# Altium schematic sheet PC104_Connectors.SchDoc
size Letter; SheetNumber: 1; SheetTotal: 2
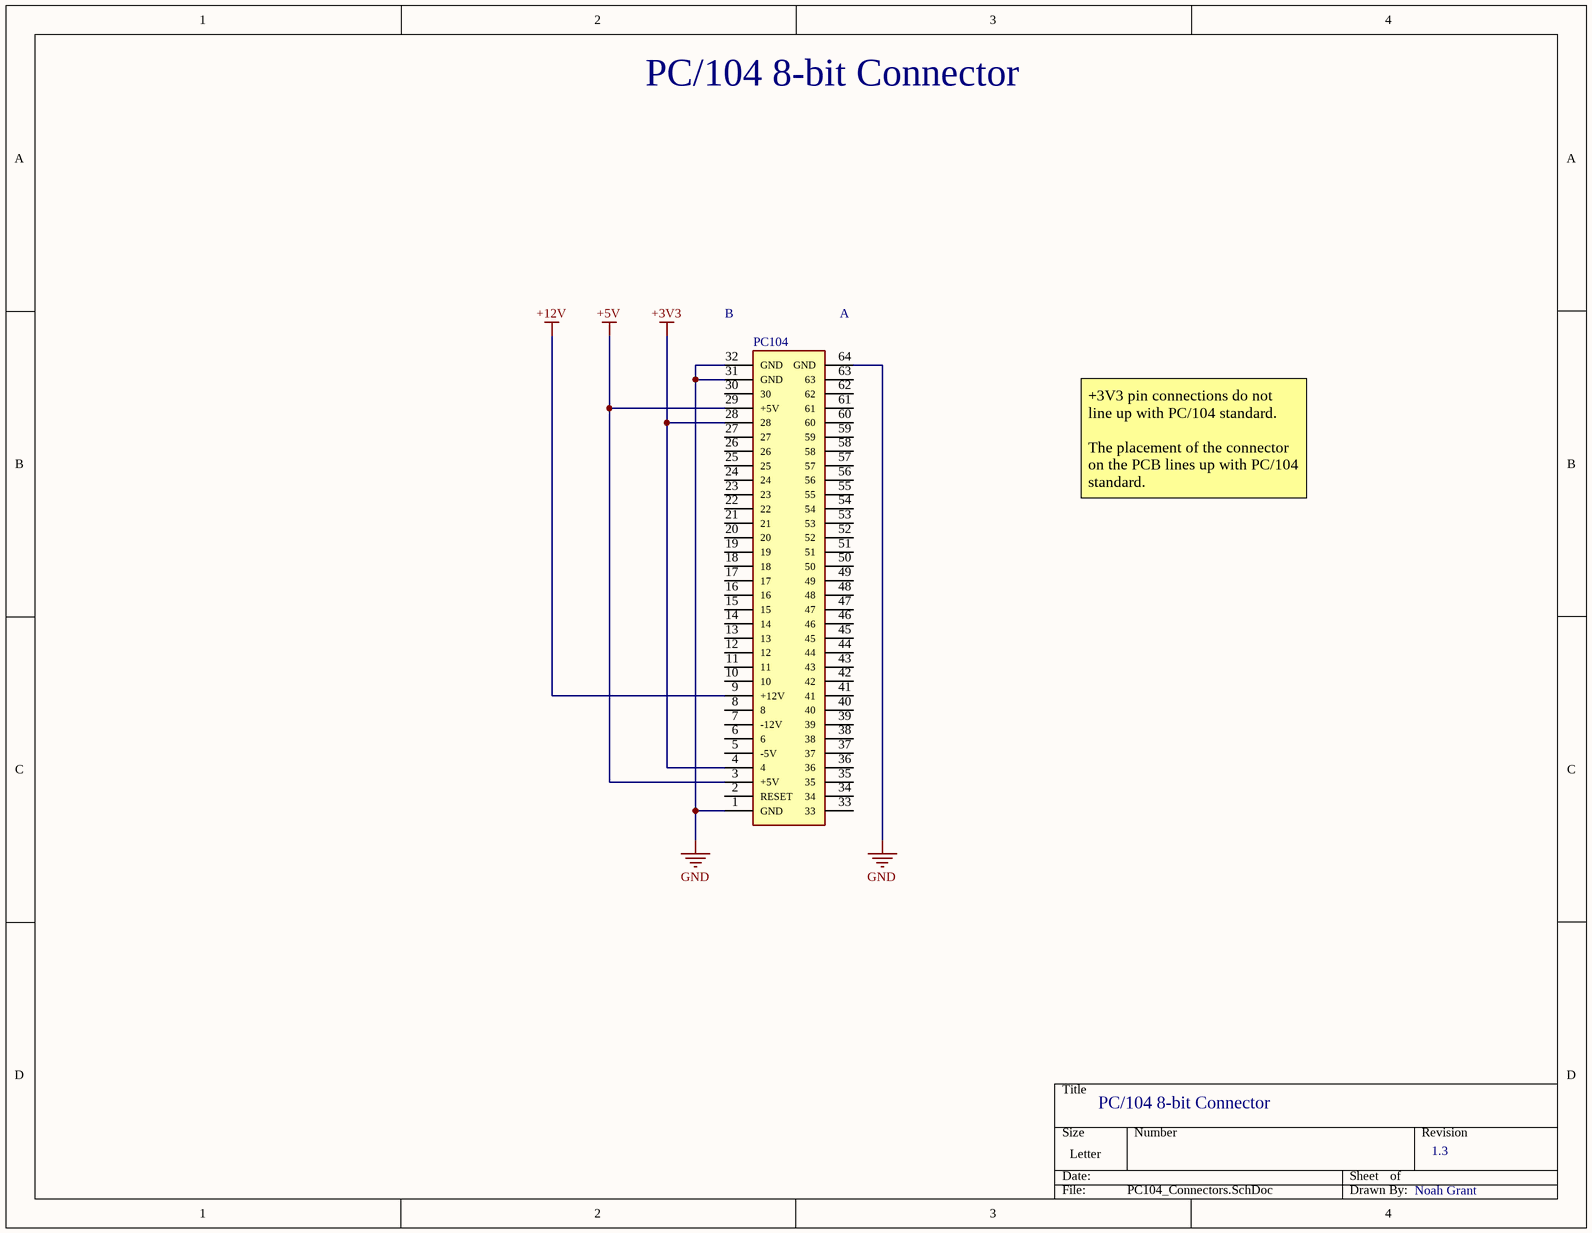
[diagram p0: PC104_Connectors.SchDoc]

## Parts
PC104  10153302-32111LF  [RHDR64W74P254_2X32_8238X499X1115P]  (value not drawn)

## Nets
+3V3: PC104.4 PC104.28
+5V: PC104.3(+5V) PC104.29(+5V)
+12V: PC104.9(+12V)
GND: PC104.1(GND) PC104.31(GND) PC104.32(GND) PC104.64(GND)

Not connected (* = marked no-connect by the designer): PC104 2(RESET) 5(-5V) 6 7(-12V) 8 10 11 12 13 14 15 16 17 18 19 20 21 22 23 24 25 26 27 30 33 34 35 36 37 38 39 40 41 42 43 44 45 46 47 48 49 50 51 52 53 54 55 56 57 58 59 60 61 62 63

## Notes on the sheet
- PC/104 8-bit Connector
- (near PC104) B
- (near PC104) A
- +3V3 pin connections do not line up with PC/104 standard.
  The placement of the connector on the PCB lines up with PC/104 standard.
- 1.3
- Noah Grant

## Library data of the parts
PC104 = 10153302-32111LF: Connector; Manufacturer_Name: Amphenol Communication Solutions; Datasheet Link: https://cdn.amphenol-cs.com/media/wysiwyg/files/drawing/10153302.pdf; Height: 11.15mm; Manufacturer_Part_Number: 10153302-32111LF